# Altium schematic sheet RF_HACK_shematic.SchDoc
size A4 portrait; Organization: Altium Limited; Address4: 2024
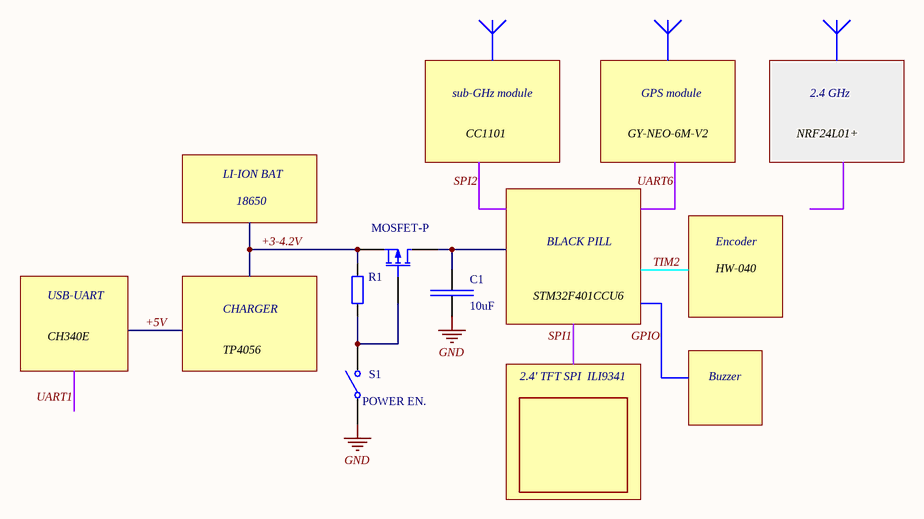
[diagram p0: RF_HACK_shematic.SchDoc]

## Parts
C1  10uF  [CAPC1608X90]
Q1  MOSFET-P  [E3]
R1  4.7K  [AXIAL-0.4]  (value not drawn)
S1  POWER EN.  [SPST-2]

## Nets
GND: C1.1 S1.1(COMMON)
+3-4.2V: Q1.3(S) R1.2
NetC1_2: C1.2 Q1.1(D)
NetQ1_2: Q1.2(G) R1.1 S1.2(NO)

## Notes on the sheet
- sub-GHz module
- GPS module
- 2.4 GHz
- CC1101
- GY-NEO-6M-V2
- NRF24L01+
- LI-ION BAT
- 18650
- USB-UART
- STM32F401CCU6
- BLACK PILL
- HW-040
- Encoder
- CH340E
- CHARGER
- TP4056
- 2.4' TFT SPI  ILI9341
- Buzzer
- Labels drawn without touching a wire or pin: GPIO
- Title
- Size:
- Date:
- A4
- Number:
- Time:
- Revision:
- Sheet
- of
- File:

## Library data of the parts
C1 = CC0603MRX5R8BB106: Керамический ЧИП-конденсатор 0603 X5R 10мкФ ±20% 25В
Q1 = MOSFET-P: P-Channel MOSFET; Published: 8-Jun-2000; LatestRevisionDate: 17-Jul-2002; LatestRevisionNote: Re-released for DXP Platform.; PackageVersion: 1995/1996; PackageReference: E3; Publisher: Altium Limited; PackageDescription: TO, Flat Index; 3 In-Line, Axial Leads; Body Dia. 4.6mm; Lead Dia. 0.5 mm (max)
R1 = Res2: Resistor; Published: 8-Jun-2000; LatestRevisionDate: 17-Jul-2002; LatestRevisionNote: Re-released for DXP Platform.; PackageReference: AXIAL-0.4; Publisher: Altium Limited; PackageDescription: Axial Device, Thru-Hole; 2 Leads; 0.4 in Pin Spacing
S1 = SW-SPST: Single-Pole, Single-Throw Switch; Published: 24-Mar-1999; LatestRevisionDate: 17-Jul-2002; LatestRevisionNote: Re-released for DXP Platform.; PackageReference: SPST-2; Publisher: Altium Limited; PackageDescription: Switch; 2 Leads